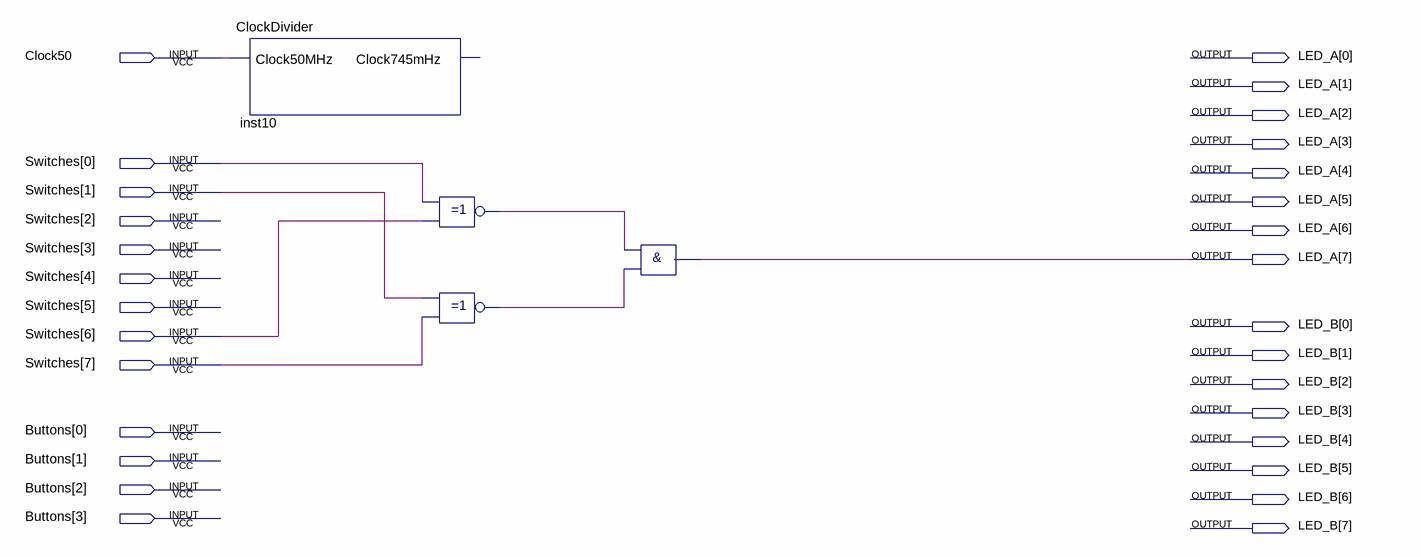
[diagram p0: schematic sheet]
// Quartus schematic 2BitKomperator.bdf as structural Verilog: 4 symbols, 29 pins
module \2BitKomperator  (
  input  Clock50,
  input  [7:0] Switches,
  input  [3:0] Buttons,
  output [7:0] LED_A,
  output [7:0] LED_B
);

  wire inst1_out, inst2_out;

  ClockDivider inst10 (.Clock50MHz(Clock50));  // open: Clock745mHz
  xnor inst1 (inst1_out, Switches[0], Switches[6]);
  xnor inst2 (inst2_out, Switches[1], Switches[7]);
  and inst5 (LED_A[7], inst1_out, inst2_out);
endmodule
